# Altium schematic sheet breath_led.SchDoc
size A4
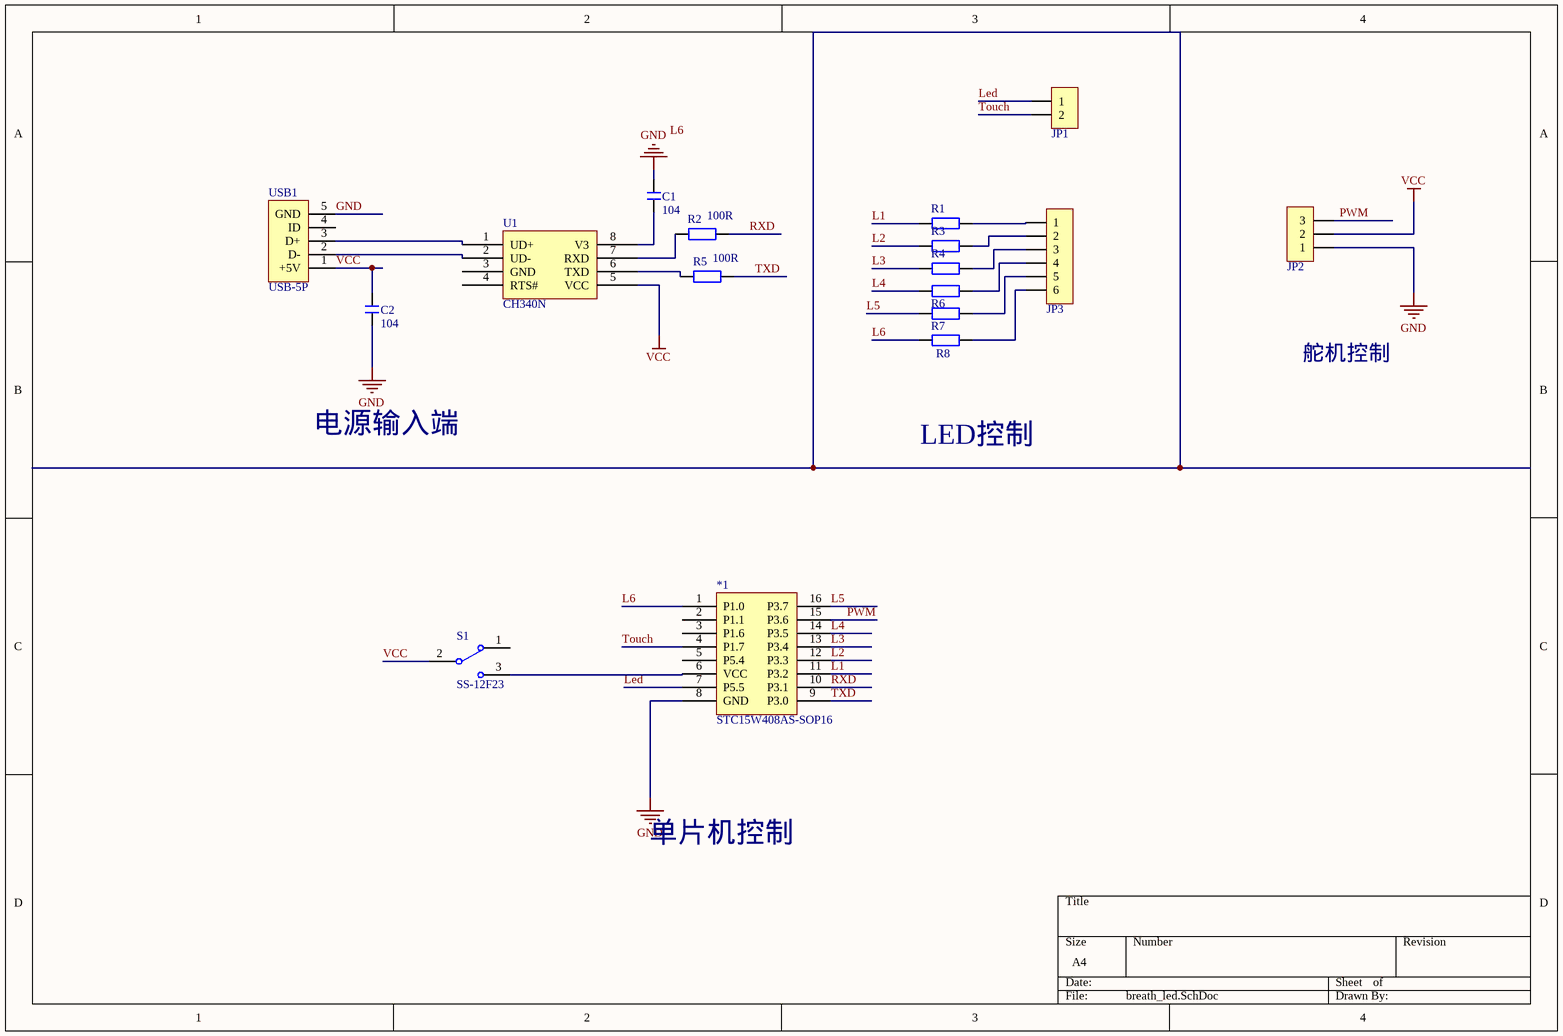
[diagram p0: breath_led.SchDoc]

## Parts
*1  STC15W408AS-SOP16  [SOP16_M]
C1  104  [C 0805]
C2  104  [C 0805]
JP1  HDR-1X2  [HDR-1X2]  (value not drawn)
JP2  HDR-1X3  [HDR-1X3]  (value not drawn)
JP3  HDR-1X6  [HDR-1X6]  (value not drawn)
R1  1K  [R 0805]  (value not drawn)
R2  100R  [R 0805]
R3  1K  [R 0805]  (value not drawn)
R4  1K  [R 0805]  (value not drawn)
R5  100R  [R 0805]
R6  1K  [R 0805]  (value not drawn)
R7  1K  [R 0805]  (value not drawn)
R8  1K  [R 0805]  (value not drawn)
S1  SS-12F23  [MSK-12C01-07]
U1  CH340N  [SOP8W_L]
USB1  USB-5P  [USB-MICRO_A]

## Nets
GND: *1.8(GND) C1.2 C2.1 JP2.1 USB1.5(GND)
VCC: C2.2 JP2.2 S1.2 U1.5(VCC) USB1.1(+5V)
L1: *1.11(P3.2) R1.1
L2: *1.12(P3.3) R3.1
L3: *1.13(P3.4) R4.1
L4: *1.14(P3.5) R6.1
L5: *1.16(P3.7) R7.1
L6: *1.1(P1.0) R8.1
Led: *1.7(P5.5) JP1.1
PWM: *1.15(P3.6) JP2.3
RXD: *1.10(P3.1) R2.2
Touch: *1.4(P1.7) JP1.2
TXD: *1.9(P3.0) R5.2
Net*1_6: *1.6(VCC) S1.3
NetC1_1: C1.1 U1.8(V3)
NetJP3_1: JP3.1 R1.2
NetJP3_2: JP3.2 R3.2
NetJP3_3: JP3.3 R4.2
NetJP3_4: JP3.4 R6.2
NetJP3_5: JP3.5 R7.2
NetJP3_6: JP3.6 R8.2
NetR2_1: R2.1 U1.7(RXD)
NetR5_1: R5.1 U1.6(TXD)
NetU1_1: U1.1(UD+) USB1.3(D+)
NetU1_2: U1.2(UD-) USB1.2(D-)

Not connected (* = marked no-connect by the designer): *1 2(P1.1) 3(P1.6) 5(P5.4); S1 1; U1 3(GND) 4(RTS#); USB1 4(ID)

## Notes on the sheet
- 舵机控制
- 电源输入端
- LED控制
- 单片机控制
- Labels drawn without touching a wire or pin: L6

## Library data of the parts
*1 = STC8F2K16S2-SOP16
C1 C2 = C: 无极性贴片电容; 版权归属: 黎明电子style; BOM名称: 无极性贴片电容; 学习资源: https://lmdzstyle.taobao.com/
JP1 = Header 2: 2P接插件; 版权归属: 黎明电子style; BOM名称: 2P接插件; 学习资源: https://lmdzstyle.taobao.com/
JP2 = Header 3: 3P接插件; 版权归属: 黎明电子style; BOM名称: 3P接插件; 学习资源: https://lmdzstyle.taobao.com/
JP3 = Header 6: 6P接插件; 版权归属: 黎明电子style; BOM名称: 6P接插件; 学习资源: https://lmdzstyle.taobao.com/
R1-R8 = R: 贴片电阻; 版权归属: 黎明电子style; BOM名称: 贴片电阻; 学习资源: https://lmdzstyle.taobao.com/
S1 = SSW-1P: 1路波动开关; BOM名称: 波动开关; 版权归属: 黎明电子style; 学习资源: https://lmdzstyle.taobao.com/
U1 = SOP20
USB1 = USB-5P: 微型USB母座; 版权归属: 黎明电子style; BOM名称: 微型USB母座; 学习资源: https://lmdzstyle.taobao.com/